# Altium project USB-SMB-ISO-CP2112.PrjPcb (part 2 of 2)

## Sheet 7_MountingHoles.SchDoc: MountingHoles
size A4; ApprovedBy: Alcatraz; CheckedBy: Alcatraz; Author: Alcatraz; CompanyName: DHNLAB; DrawnBy: Alcatraz; Engineer: Alcatraz; Organization: DHNLAB PVT LTD; Address1: DHANBAD; Address2: JHARKHAND; Address3: INDIA; Address4: ASIA; DocumentNumber: 6; Revision: 1.0; SheetNumber: 6; SheetTotal: 6; ProjectTitle: USB-SMB-ISO-CP2112
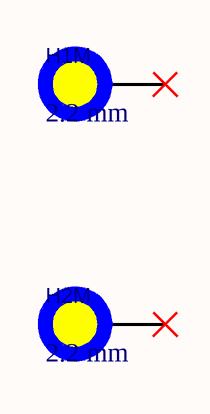
[diagram p5: 7_MountingHoles.SchDoc]

### Parts
H1M  2.2 mm  [MountingHole_2.2mm_M2_Pad_Via_Mask]  (no BOM)
H2M  2.2 mm  [MountingHole_2.2mm_M2_Pad_Via_Mask]  (no BOM)

### Nets

Not connected (* = marked no-connect by the designer): H1M 1*; H2M 1*

### Notes on the sheet
- Title:
- Author:
- Approved:
- Size:
- Date:
- Git Hash:
- A4
- Prj:
- SW Version:
- Variant:
- Edited:
- PUBLIC
- File:

### Library data of the parts
H1M H2M = MountingHole_Pad_2.2mm(M2): ki_description: Mounting Hole with connection; ki_fp_filters: MountingHole*Pad*; Supplier: ~; ki_keywords: mounting hole; Value: 2.2 mm

## Nets that join several sheets
+3VALW: 2_LDO (C3L.1 D1L.2 R0L.1 U1L.5), 3_USB_TO_UART (7 pins), 4_Digital_Isolator (5 pins), 6_Connector (J2C.11 J2C.13)
+5V_BUCK: 1_Power_Path (F1P.2), 2_LDO (C1L.1 C2L.1 R3L.1 U1L.1), 3_USB_TO_UART (C1U.1 C2U.1 U1U.7 U1U.8), 6_Connector (J2C.15 J2C.17)
+5V_VBUS: 1_Power_Path (C1P.1 Q1P.1-2-5-6-7), 3_USB_TO_UART (D1U.5), 6_Connector (J1C.A4-B9 J1C.B4-A9)
GND: 1_Power_Path (C1P.2 R1P.2), 2_LDO (6 pins), 3_USB_TO_UART (9 pins), 4_Digital_Isolator (C1I.2 C2I.2 U1I.4), 6_Connector (8 pins)
GND-ISO: 1_Power_Path (C2P.2 C3P.2 R2P.2), 4_Digital_Isolator (C3I.2 C4I.2 U1I.5), 6_Connector (J3C.1 J3C.2)
VCC: 1_Power_Path (C3P.1 Q2P.1-2-5-6-7), 6_Connector (J3C.3 J3C.4)
VDD: 1_Power_Path (C2P.1 F2P.2), 4_Digital_Isolator (5 pins)
CP2102_USB_N: 3_USB_TO_UART (D1U.3 U1U.4), 6_Connector (J1C.A7 J1C.B7)
CP2102_USB_P: 3_USB_TO_UART (D1U.4 U1U.3), 6_Connector (J1C.A6 J1C.B6)
GPIO_2: 3_USB_TO_UART (U1U.21), 6_Connector (J2C.6)
GPIO_3: 3_USB_TO_UART (U1U.20), 6_Connector (J2C.8)
GPIO_4: 3_USB_TO_UART (U1U.15), 6_Connector (J2C.12)
GPIO_5: 3_USB_TO_UART (U1U.14), 6_Connector (J2C.14)
GPIO_6: 3_USB_TO_UART (U1U.13), 6_Connector (J2C.16)
GPIO_7_CLK: 3_USB_TO_UART (U1U.12), 6_Connector (J2C.18)
RST#: 3_USB_TO_UART (R1U.2 U1U.9), 6_Connector (J2C.1)
SCL: 3_USB_TO_UART (U1U.24), 4_Digital_Isolator (R1I.2 U1I.3), 6_Connector (J2C.4)
SCL_ISO: 4_Digital_Isolator (R4I.2 U1I.6), 6_Connector (J3C.6 J3C.7)
SDA: 3_USB_TO_UART (U1U.1), 4_Digital_Isolator (R2I.2 U1I.2), 6_Connector (J2C.2)
SDA_ISO: 4_Digital_Isolator (R3I.2 U1I.7), 6_Connector (J3C.5 J3C.8)
SUSPEND: 3_USB_TO_UART (U1U.11), 6_Connector (J2C.3)
SUSPEND#: 3_USB_TO_UART (R2U.1 U1U.17), 6_Connector (J2C.5)